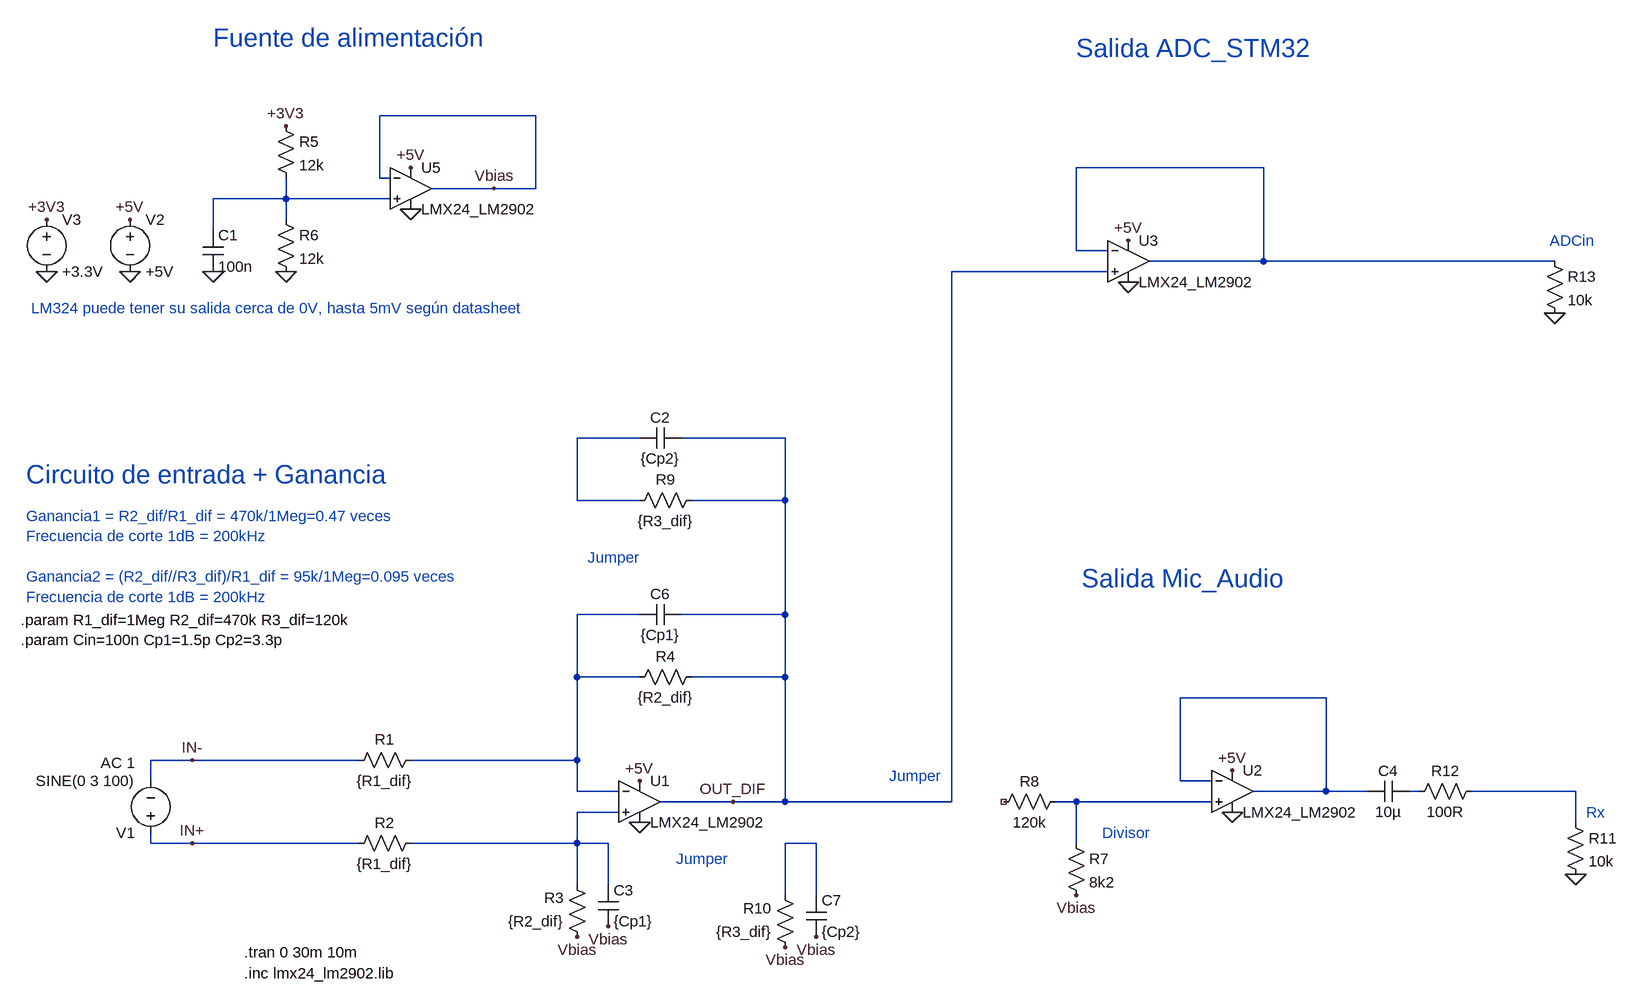
[diagram p0: schematic osciloscopio_LM324.asc]
osciloscopio_LM324.asc, the LTspice schematic file:
Version 4
SHEET 1 1892 680
WIRE 64 -960 -176 -960
WIRE 1184 -880 896 -880
WIRE -176 -864 -176 -960
WIRE -160 -864 -176 -864
WIRE 0 -848 -96 -848
WIRE 64 -848 64 -960
WIRE 64 -848 0 -848
WIRE -320 -832 -320 -864
WIRE -320 -832 -432 -832
WIRE -160 -832 -320 -832
WIRE -320 -800 -320 -832
WIRE -432 -784 -432 -832
WIRE 896 -752 896 -880
WIRE 944 -752 896 -752
WIRE 1184 -736 1184 -880
WIRE 1184 -736 1008 -736
WIRE 1632 -736 1184 -736
WIRE 944 -720 704 -720
WIRE 224 -464 128 -464
WIRE 448 -464 288 -464
WIRE 128 -368 128 -464
WIRE 224 -368 128 -368
WIRE 448 -368 448 -464
WIRE 448 -368 304 -368
WIRE 224 -192 128 -192
WIRE 448 -192 448 -368
WIRE 448 -192 288 -192
WIRE 128 -96 128 -192
WIRE 224 -96 128 -96
WIRE 448 -96 448 -192
WIRE 448 -96 304 -96
WIRE 1280 -64 1056 -64
WIRE -464 32 -528 32
WIRE -208 32 -464 32
WIRE 128 32 128 -96
WIRE 128 32 -128 32
WIRE -528 64 -528 32
WIRE 1056 64 1056 -64
WIRE 1104 64 1056 64
WIRE 128 80 128 32
WIRE 192 80 128 80
WIRE 1280 80 1280 -64
WIRE 1280 80 1168 80
WIRE 1344 80 1280 80
WIRE 1424 80 1408 80
WIRE 1664 80 1504 80
WIRE 368 96 256 96
WIRE 448 96 448 -96
WIRE 448 96 368 96
WIRE 704 96 704 -720
WIRE 704 96 448 96
WIRE 896 96 864 96
WIRE 1104 96 896 96
WIRE 192 112 128 112
WIRE 1664 128 1664 80
WIRE -528 160 -528 144
WIRE -464 160 -528 160
WIRE -208 160 -464 160
WIRE 128 160 128 112
WIRE 128 160 -128 160
WIRE 176 160 128 160
WIRE 496 160 448 160
WIRE 896 160 896 96
WIRE 128 224 128 160
WIRE 176 224 176 160
WIRE 448 240 448 160
WIRE 496 240 496 160
FLAG -560 -720 0
FLAG -560 -800 +5V
FLAG 224 64 +5V
FLAG 368 96 OUT_DIF
FLAG -464 32 IN-
FLAG -464 160 IN+
FLAG -128 -880 +5V
FLAG -320 -944 +3V3
FLAG -320 -720 0
FLAG 0 -848 Vbias
FLAG -432 -720 0
FLAG 128 304 Vbias
FLAG 448 320 Vbias
FLAG 496 304 Vbias
FLAG -688 -720 0
FLAG -688 -800 +3V3
FLAG 224 128 0
FLAG -128 -816 0
FLAG 1136 48 +5V
FLAG 1136 112 0
FLAG 1664 208 0
FLAG 976 -768 +5V
FLAG 976 -704 0
FLAG 1632 -656 0
FLAG 896 240 Vbias
FLAG 176 288 Vbias
SYMBOL res -112 16 R90
WINDOW 0 0 56 VBottom 2
WINDOW 3 32 56 VTop 2
SYMATTR InstName R1
SYMATTR Value {R1_dif}
SYMBOL res -112 144 R90
WINDOW 0 0 56 VBottom 2
WINDOW 3 32 56 VTop 2
SYMATTR InstName R2
SYMATTR Value {R1_dif}
SYMBOL res 144 320 R180
WINDOW 0 36 76 Left 2
WINDOW 3 36 40 Left 2
SYMATTR InstName R3
SYMATTR Value {R2_dif}
SYMBOL res 208 -80 R270
WINDOW 0 32 56 VTop 2
WINDOW 3 0 56 VBottom 2
SYMATTR InstName R4
SYMATTR Value {R2_dif}
SYMBOL voltage -528 160 R180
WINDOW 123 24 124 Left 2
WINDOW 39 0 0 Left 0
SYMATTR Value2 AC 1
SYMATTR InstName V1
SYMATTR Value SINE(0 3 100)
SYMBOL voltage -560 -816 R0
WINDOW 123 0 0 Left 0
WINDOW 39 0 0 Left 0
SYMATTR InstName V2
SYMATTR Value +5V
SYMBOL res -336 -960 R0
SYMATTR InstName R5
SYMATTR Value 12k
SYMBOL res -336 -816 R0
SYMATTR InstName R6
SYMATTR Value 12k
SYMBOL cap -448 -784 R0
SYMATTR InstName C1
SYMATTR Value 100n
SYMBOL res 208 -352 R270
WINDOW 0 32 56 VTop 2
WINDOW 3 0 56 VBottom 2
SYMATTR InstName R9
SYMATTR Value {R3_dif}
SYMBOL res 464 336 R180
WINDOW 0 36 76 Left 2
WINDOW 3 36 40 Left 2
SYMATTR InstName R10
SYMATTR Value {R3_dif}
SYMBOL cap 288 -208 R90
WINDOW 0 0 32 VBottom 2
WINDOW 3 32 32 VTop 2
SYMATTR InstName C6
SYMATTR Value {Cp1}
SYMBOL cap 480 240 R0
SYMATTR InstName C7
SYMATTR Value {Cp2}
SYMBOL voltage -688 -816 R0
WINDOW 123 0 0 Left 0
WINDOW 39 0 0 Left 0
SYMATTR InstName V3
SYMATTR Value +3.3V
SYMBOL res 1648 112 R0
SYMATTR InstName R11
SYMATTR Value 10k
SYMBOL res 880 144 R0
SYMATTR InstName R7
SYMATTR Value 8k2
SYMBOL res 880 80 R90
WINDOW 0 0 56 VBottom 2
WINDOW 3 32 56 VTop 2
SYMATTR InstName R8
SYMATTR Value 120k
SYMBOL res 1616 -752 R0
SYMATTR InstName R13
SYMATTR Value 10k
SYMBOL cap 1408 64 R90
WINDOW 0 0 32 VBottom 2
WINDOW 3 32 32 VTop 2
SYMATTR InstName C4
SYMATTR Value 10µ
SYMBOL res 1520 64 R90
WINDOW 0 0 56 VBottom 2
WINDOW 3 32 56 VTop 2
SYMATTR InstName R12
SYMATTR Value 100R
SYMBOL OpAmps\\opamp2 224 32 R0
SYMATTR InstName U1
SYMATTR Value LMX24_LM2902
SYMBOL OpAmps\\opamp2 1136 16 R0
SYMATTR InstName U2
SYMATTR Value LMX24_LM2902
SYMBOL OpAmps\\opamp2 976 -800 R0
SYMATTR InstName U3
SYMATTR Value LMX24_LM2902
SYMBOL OpAmps\\opamp2 -128 -912 R0
SYMATTR InstName U5
SYMATTR Value LMX24_LM2902
SYMBOL cap 288 -480 R90
WINDOW 0 0 32 VBottom 2
WINDOW 3 32 32 VTop 2
SYMATTR InstName C2
SYMATTR Value {Cp2}
SYMBOL cap 160 224 R0
SYMATTR InstName C3
SYMATTR Value {Cp1}
TEXT -728 -184 Left 2 !.param R1_dif=1Meg R2_dif=470k R3_dif=120k\n.param Cin=100n Cp1=1.5p Cp2=3.3p
TEXT -384 360 Left 2 !.inc lmx24_lm2902.lib
TEXT -384 328 Left 2 !.tran 0 30m 10m
TEXT -720 -344 Left 2 ;Ganancia1 = R2_dif/R1_dif = 470k/1Meg=0.47 veces\nFrecuencia de corte 1dB = 200kHz\n \nGanancia2 = (R2_dif//R3_dif)/R1_dif = 95k/1Meg=0.095 veces\nFrecuencia de corte 1dB = 200kHz
TEXT -432 -1080 Left 4 ;Fuente de alimentación
TEXT -720 -408 Left 4 ;Circuito de entrada + Ganancia
TEXT 144 -280 Left 2 ;Jumper
TEXT 280 184 Left 2 ;Jumper
TEXT 904 -248 Left 4 ;Salida Mic_Audio
TEXT 1680 112 Left 2 ;Rx
TEXT 1624 -768 Left 2 ;ADCin
TEXT 896 -1064 Left 4 ;Salida ADC_STM32
TEXT 936 144 Left 2 ;Divisor
TEXT -712 -664 Left 2 ;LM324 puede tener su salida cerca de 0V, hasta 5mV según datasheet
TEXT 608 56 Left 2 ;Jumper

The netlist it stands for:
* osciloscopio_LM324.asc
R1 N004 IN- {R1_dif}
R2 N009 IN+ {R1_dif}
R3 Vbias N009 {R2_dif}
R4 N004 OUT_DIF {R2_dif}
V1 IN+ IN- SINE(0 3 100) AC 1
V2 +5V 0 +5V
R5 +3V3 N002 12k
R6 N002 0 12k
C1 N002 0 100n
R9 N003 OUT_DIF {R3_dif}
R10 Vbias N010 {R3_dif}
C6 OUT_DIF N004 {Cp1}
C7 N010 Vbias {Cp2}
V3 +3V3 0 +3.3V
R11 N007 0 10k
R7 N008 Vbias 8k2
R8 N008 NC_01 120k
R13 N001 0 10k
C4 N006 N005 10µ
R12 N007 N006 100R
XU1 N009 N004 +5V 0 OUT_DIF LMX24_LM2902  ; pins In+ In- V+ V- OUT
XU2 N008 N005 +5V 0 N005 LMX24_LM2902  ; pins In+ In- V+ V- OUT
XU3 OUT_DIF N001 +5V 0 N001 LMX24_LM2902  ; pins In+ In- V+ V- OUT
XU5 N002 Vbias +5V 0 Vbias LMX24_LM2902  ; pins In+ In- V+ V- OUT
C2 OUT_DIF N003 {Cp2}
C3 N009 Vbias {Cp1}
.param R1_dif=1Meg R2_dif=470k R3_dif=120k
.param Cin=100n Cp1=1.5p Cp2=3.3p
.inc lmx24_lm2902.lib
.tran 0 30m 10m
* Ganancia1 = R2_dif/R1_dif = 470k/1Meg=0.47 veces
* Frecuencia de corte 1dB = 200kHz
* Ganancia2 = (R2_dif//R3_dif)/R1_dif = 95k/1Meg=0.095 veces
* Frecuencia de corte 1dB = 200kHz
* Fuente de alimentación
* Circuito de entrada + Ganancia
* Jumper
* Jumper
* Salida Mic_Audio
* Rx
* ADCin
* Salida ADC_STM32
* Divisor
* LM324 puede tener su salida cerca de 0V, hasta 5mV según datasheet
* Jumper
.backanno
.end